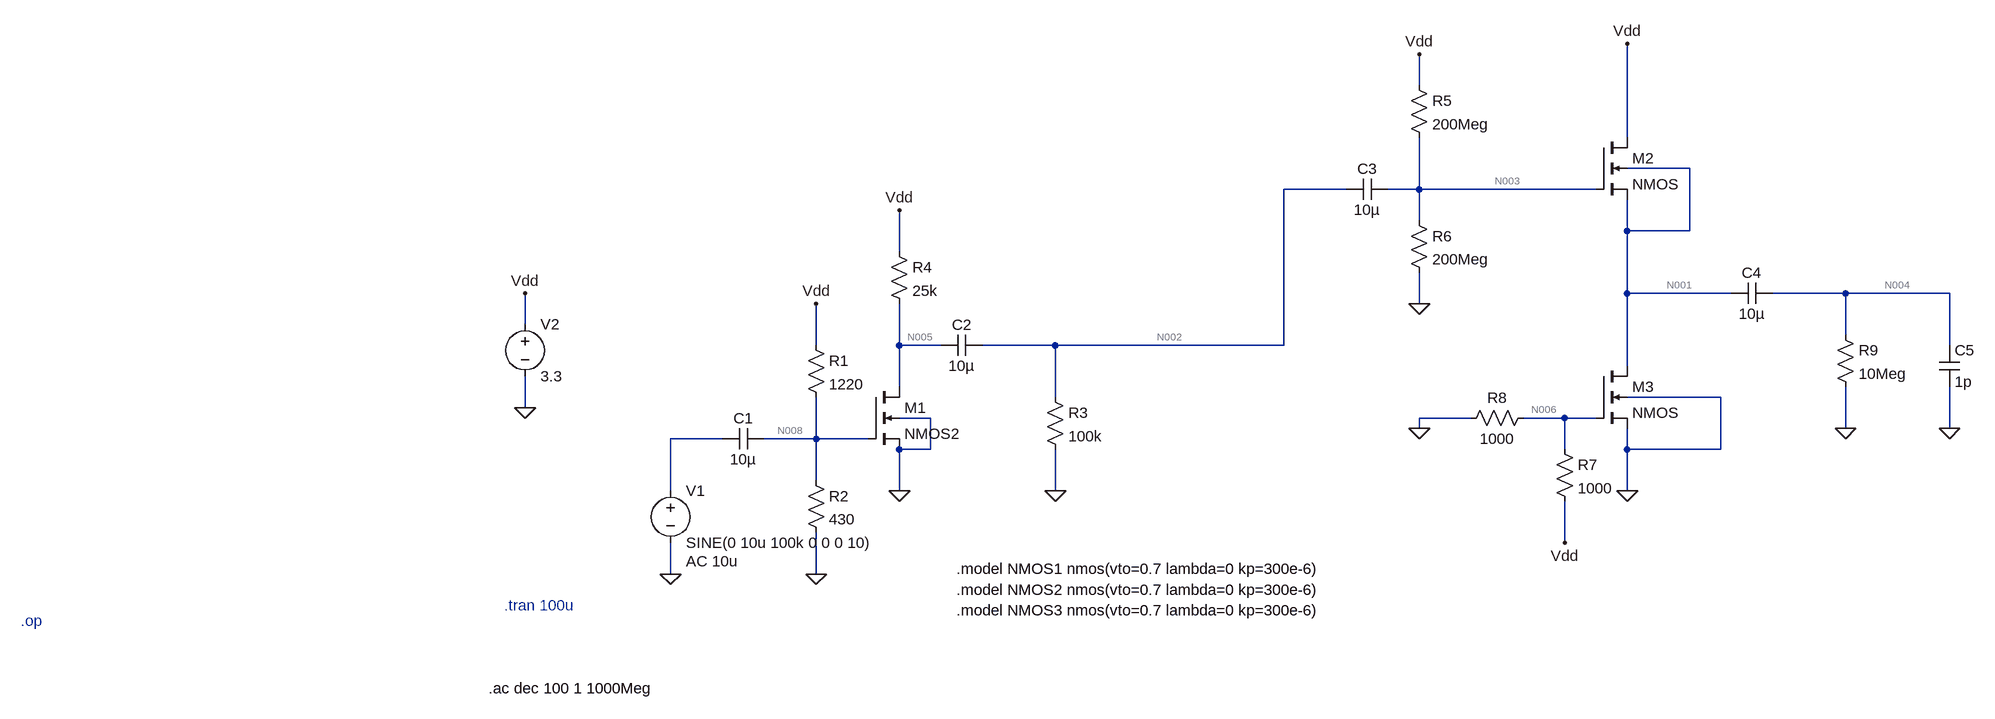
[diagram p0: schematic 1e.asc]
1e.asc, the LTspice schematic file:
Version 4.1
SHEET 1 2104 680
WIRE 1248 -464 1248 -512
WIRE 1568 -384 1568 -528
WIRE 1664 -336 1568 -336
WIRE 1136 -304 1040 -304
WIRE 1248 -304 1248 -384
WIRE 1248 -304 1200 -304
WIRE 1520 -304 1248 -304
WIRE 1248 -256 1248 -304
WIRE 1568 -240 1568 -288
WIRE 1664 -240 1664 -336
WIRE 1664 -240 1568 -240
WIRE 448 -208 448 -272
WIRE 1568 -144 1568 -240
WIRE 1728 -144 1568 -144
WIRE 1904 -144 1792 -144
WIRE 2064 -144 1904 -144
WIRE 1248 -128 1248 -176
WIRE -128 -96 -128 -144
WIRE 1904 -80 1904 -144
WIRE 320 -64 320 -128
WIRE 448 -64 448 -128
WIRE 512 -64 448 -64
WIRE 688 -64 576 -64
WIRE 1040 -64 1040 -304
WIRE 1040 -64 688 -64
WIRE 2064 -64 2064 -144
WIRE 1568 -32 1568 -144
WIRE 448 0 448 -64
WIRE 688 16 688 -64
WIRE 1712 16 1568 16
WIRE -128 32 -128 -16
WIRE 496 48 448 48
WIRE 1328 48 1248 48
WIRE 1472 48 1408 48
WIRE 1520 48 1472 48
WIRE 1248 64 1248 48
WIRE 1904 64 1904 0
WIRE 2064 64 2064 0
WIRE 176 80 96 80
WIRE 320 80 320 16
WIRE 320 80 240 80
WIRE 400 80 320 80
WIRE 496 96 496 48
WIRE 496 96 448 96
WIRE 1472 96 1472 48
WIRE 1568 96 1568 64
WIRE 1712 96 1712 16
WIRE 1712 96 1568 96
WIRE 320 144 320 80
WIRE 96 160 96 80
WIRE 448 160 448 96
WIRE 688 160 688 96
WIRE 1568 160 1568 96
WIRE 1472 240 1472 176
WIRE 96 288 96 240
WIRE 320 288 320 224
FLAG 320 -128 Vdd
FLAG -128 -144 Vdd
FLAG -128 32 0
FLAG 320 288 0
FLAG 96 288 0
FLAG 448 160 0
FLAG 688 160 0
FLAG 448 -272 Vdd
FLAG 1248 -512 Vdd
FLAG 1248 -128 0
FLAG 1568 160 0
FLAG 1568 -528 Vdd
FLAG 1472 240 Vdd
FLAG 1248 64 0
FLAG 1904 64 0
FLAG 2064 64 0
SYMBOL voltage 96 144 R0
WINDOW 123 24 124 Left 2
WINDOW 39 0 0 Left 0
SYMATTR Value2 AC 10u
SYMATTR InstName V1
SYMATTR Value SINE(0 10u 100k 0 0 0 10)
SYMBOL voltage -128 -112 R0
SYMATTR InstName V2
SYMATTR Value 3.3
SYMBOL cap 240 64 R90
WINDOW 0 0 32 VBottom 2
WINDOW 3 32 32 VTop 2
SYMATTR InstName C1
SYMATTR Value 10µ
SYMBOL res 304 -80 R0
SYMATTR InstName R1
SYMATTR Value 1220
SYMBOL res 304 128 R0
SYMATTR InstName R2
SYMATTR Value 430
SYMBOL nmos4 400 0 R0
SYMATTR InstName M1
SYMATTR Value NMOS2
SYMATTR Value2 l=1 w=26.05
SYMBOL res 672 0 R0
SYMATTR InstName R3
SYMATTR Value 100k
SYMBOL res 432 -224 R0
SYMATTR InstName R4
SYMATTR Value 25k
SYMBOL cap 576 -80 R90
WINDOW 0 0 32 VBottom 2
WINDOW 3 32 32 VTop 2
SYMATTR InstName C2
SYMATTR Value 10µ
SYMBOL cap 1200 -320 R90
WINDOW 0 0 32 VBottom 2
WINDOW 3 32 32 VTop 2
SYMATTR InstName C3
SYMATTR Value 10µ
SYMBOL res 1232 -480 R0
SYMATTR InstName R5
SYMATTR Value 200Meg
SYMBOL res 1232 -272 R0
SYMATTR InstName R6
SYMATTR Value 200Meg
SYMBOL nmos4 1520 -384 R0
SYMATTR InstName M2
SYMATTR Value2 l=1 w=23
SYMBOL nmos4 1520 -32 R0
SYMATTR InstName M3
SYMBOL res 1456 80 R0
SYMATTR InstName R7
SYMATTR Value 1000
SYMBOL res 1424 32 R90
WINDOW 0 0 56 VBottom 2
WINDOW 3 32 56 VTop 2
SYMATTR InstName R8
SYMATTR Value 1000
SYMBOL res 1888 -96 R0
SYMATTR InstName R9
SYMATTR Value 10Meg
SYMBOL cap 1792 -160 R90
WINDOW 0 0 32 VBottom 2
WINDOW 3 32 32 VTop 2
SYMATTR InstName C4
SYMATTR Value 10µ
SYMBOL cap 2048 -64 R0
SYMATTR InstName C5
SYMATTR Value 1p
TEXT 536 312 Left 2 !.model NMOS2 nmos(vto=0.7 lambda=0 kp=300e-6)
TEXT -160 336 Left 2 ;.tran 100u
TEXT -904 360 Left 2 ;.op
TEXT -184 464 Left 2 !.ac dec 100 1 1000Meg
TEXT 536 280 Left 2 !.model NMOS1 nmos(vto=0.7 lambda=0 kp=300e-6)
TEXT 536 344 Left 2 !.model NMOS3 nmos(vto=0.7 lambda=0 kp=300e-6)

The netlist it stands for:
* 1e.asc
V1 N007 0 SINE(0 10u 100k 0 0 0 10) AC 10u
V2 Vdd 0 3.3
C1 N008 N007 10µ
R1 Vdd N008 1220
R2 N008 0 430
M1 N005 N008 0 0 NMOS2 l=1 w=26.05
R3 N002 0 100k
R4 Vdd N005 25k
C2 N002 N005 10µ
C3 N003 N002 10µ
R5 Vdd N003 200Meg
R6 N003 0 200Meg
M2 Vdd N003 N001 N001 NMOS l=1 w=23
M3 N001 N006 0 0 NMOS
R7 N006 Vdd 1000
R8 N006 0 1000
R9 N004 0 10Meg
C4 N004 N001 10µ
C5 N004 0 1p
.model NMOS NMOS
.model PMOS PMOS
.lib standard.mos
.model NMOS2 nmos(vto=0.7 lambda=0 kp=300e-6)
* .tran 100u
* .op
.ac dec 100 1 1000Meg
.model NMOS1 nmos(vto=0.7 lambda=0 kp=300e-6)
.model NMOS3 nmos(vto=0.7 lambda=0 kp=300e-6)
.backanno
.end

* Results of the author's LTspice run, read from the files saved beside the schematic
* Operating Point, zero values left out:
*   V(vdd) = 3.3 V
*   V(n005) = 799.2 mV
*   V(n001) = 1.313 V
*   V(n008) = 860 mV
*   V(n003) = 1.65 V
*   V(n006) = 1.65 V
*   I(R2) = 2 mA
*   Id(M1) = 100 µA
*   Is(M1) = -100 µA
*   I(R4) = 100 µA
*   I(R5) = 8.25 nA
*   I(R8) = 1.65 mA
*   Id(M2) = 26.09 µA
*   Is(M2) = -26.09 µA
*   Ib(M2) = -1.997 pA
*   Id(M3) = 26.09 µA
*   Is(M3) = -26.09 µA
*   Ib(M3) = -1.323 pA
*   I(R6) = 8.25 nA
*   I(R7) = -1.65 mA
*   I(V2) = -3.776 mA
*   I(R1) = 2 mA
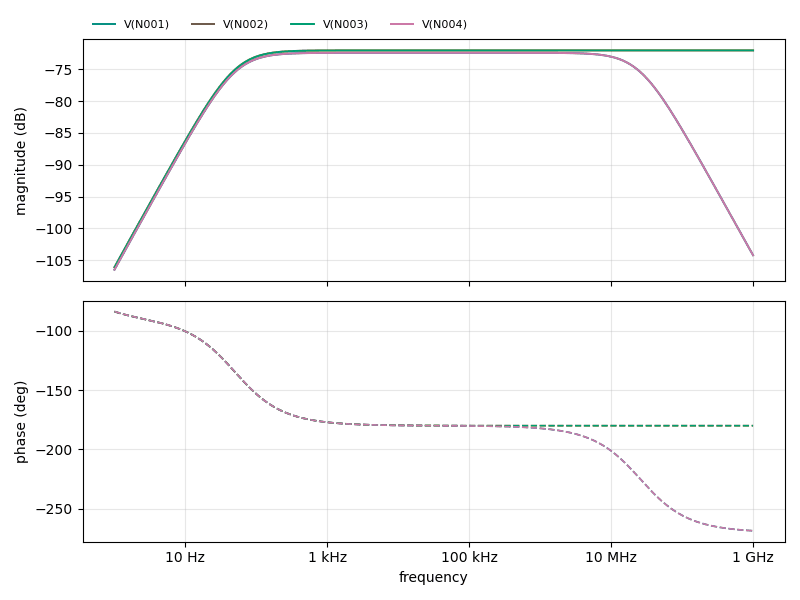
[diagram p1: AC Analysis of 1e.asc, plotted from the saved traces]
* AC Analysis, 1 run:
*   V(N001): -106.48 dB at 1 Hz, -104.20 dB at 1 GHz, peak -72.42 dB at 36.31 kHz, 3 dB below the peak at 50.06 Hz and 25.75 MHz
*   V(N002): -106.10 dB at 1 Hz, -72.04 dB at 1 GHz, peak -72.04 dB at 851.1 MHz, 3 dB below the peak at 50.06 Hz
*   V(N003): -106.10 dB at 1 Hz, -72.04 dB at 1 GHz, peak -72.04 dB at 851.1 MHz, 3 dB below the peak at 50.06 Hz
*   V(N004): -106.48 dB at 1 Hz, -104.20 dB at 1 GHz, peak -72.42 dB at 36.31 kHz, 3 dB below the peak at 50.06 Hz and 25.75 MHz